# EAGLE design Gen7_ICSP (EAGLE 5.10)
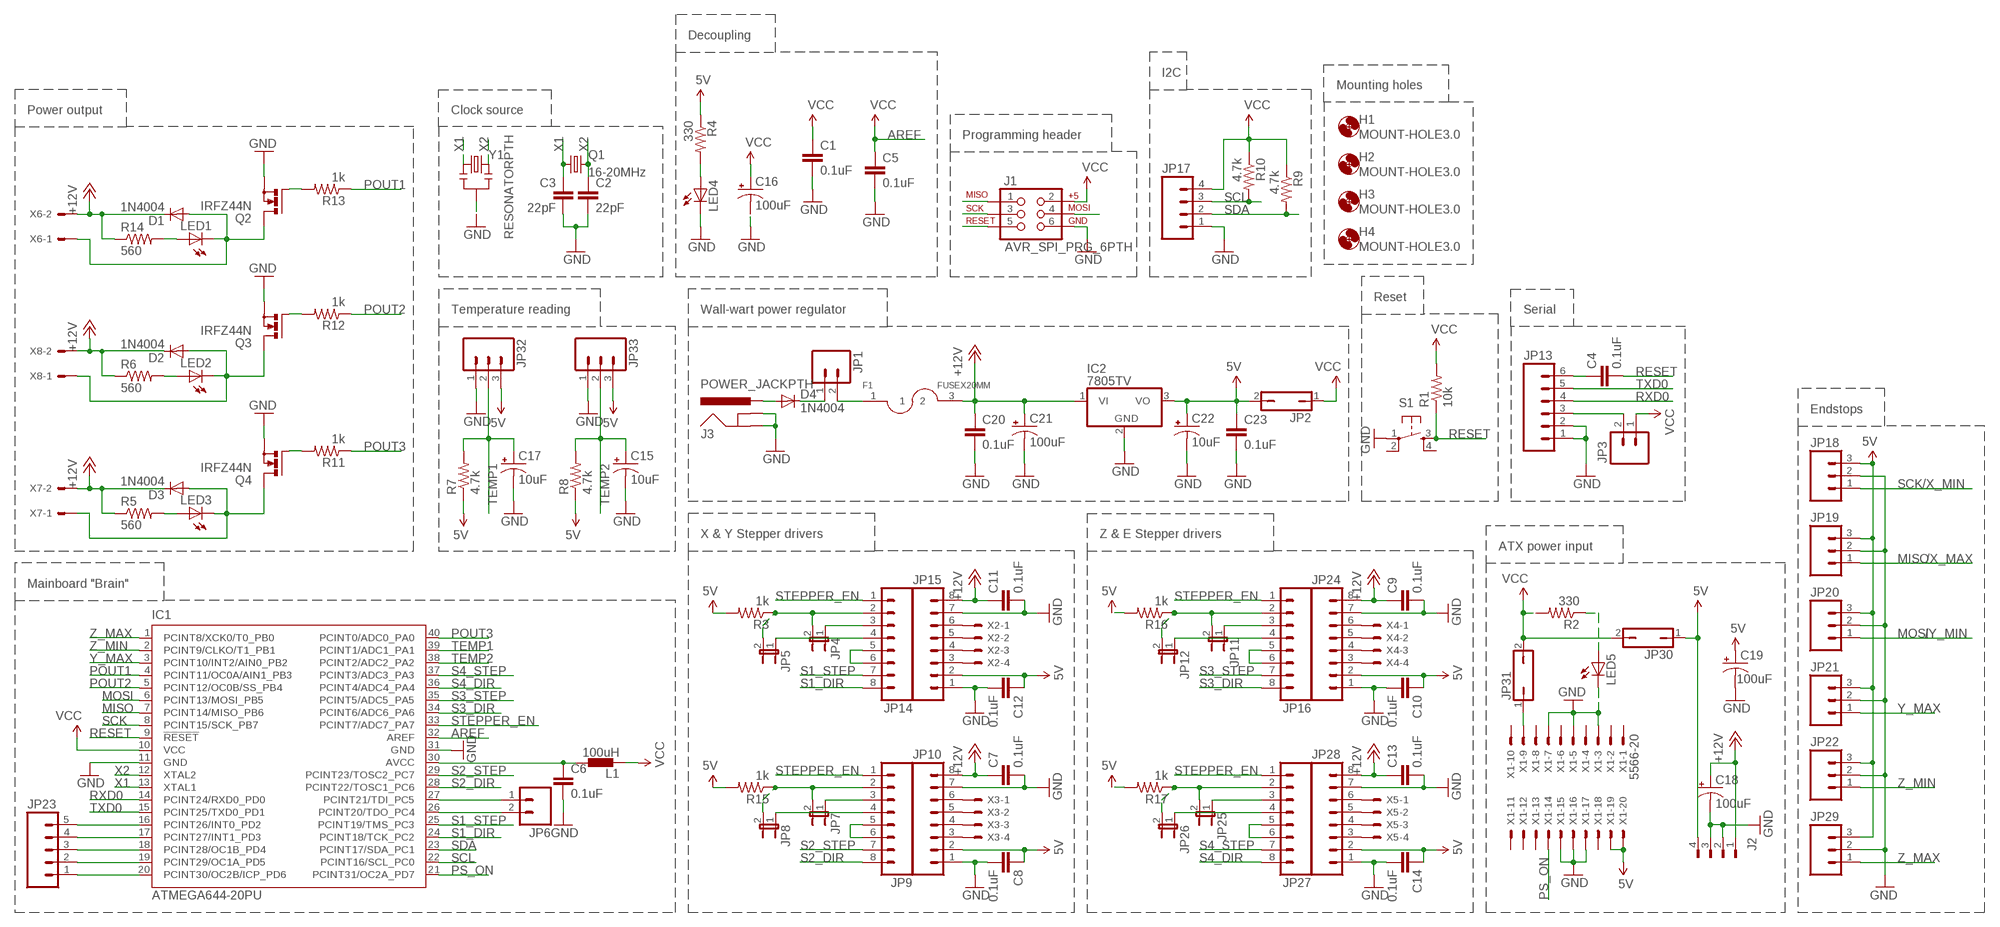
[diagram p0: schematic, sheet 1]

## Parts
C1  0.1uF  CAPPTH  [CAP-PTH-SMALL]
C2  22pF  CAPPTH  [CAP-PTH-SMALL]
C3  22pF  CAPPTH  [CAP-PTH-SMALL]
C4  0.1uF  CAP_  [AXIAL-5MM]
C5  0.1uF  CAPPTH  [CAP-PTH-SMALL]
C6  0.1uF  CAPPTH  [CAP-PTH-SMALL]
C7  0.1uF  CAPPTH  [CAP-PTH-SMALL]
C8  0.1uF  CAPPTH  [CAP-PTH-SMALL]
C9  0.1uF  CAPPTH  [CAP-PTH-SMALL]
C10  0.1uF  CAPPTH  [CAP-PTH-SMALL]
C11  0.1uF  CAPPTH  [CAP-PTH-SMALL]
C12  0.1uF  CAPPTH  [CAP-PTH-SMALL]
C13  0.1uF  CAPPTH  [CAP-PTH-SMALL]
C14  0.1uF  CAPPTH  [CAP-PTH-SMALL]
C15  10uF  CAP_POLPTH2  [CPOL-RADIAL-10UF-25V]
C16  100uF  CAP_POLPTH1  [CPOL-RADIAL-100UF-25V]
C17  10uF  CAP_POLPTH2  [CPOL-RADIAL-10UF-25V]
C18  100uF  CAP_POLPTH1  [CPOL-RADIAL-100UF-25V]
C19  100uF  CAP_POLPTH1  [CPOL-RADIAL-100UF-25V]
C20  0.1uF  CAPPTH  [CAP-PTH-SMALL]
C21  100uF  CAP_POLPTH1  [CPOL-RADIAL-100UF-25V]
C22  10uF  CAP_POLPTH2  [CPOL-RADIAL-10UF-25V]
C23  0.1uF  CAPPTH  [CAP-PTH-SMALL]
D1  1N4004  [DO41-10]
D2  1N4004  [DO41-10]
D3  1N4004  [DO41-10]
D4  1N4004  DIODE-C1702-05  [C1702-05]
F1  FUSEX20MM  [FUSE_5MM]
H1  MOUNT-HOLE3.0  [3,0]
H2  MOUNT-HOLE3.0  [3,0]
H3  MOUNT-HOLE3.0  [3,0]
H4  MOUNT-HOLE3.0  [3,0]
IC1  ATMEGA644-20PU  [DIL40]
IC2  7805TV  [TO220V]
J1  AVR_SPI_PRG_6PTH  [2X3]
J2  FLOPPY-4350211  [350211]
J3  POWER_JACKPTH  [POWER_JACK_PTH]
JP1  M02PTH  [1X02]
JP2  JP1Q  [JP1]
JP3  M02PTH  [1X02]
JP4  JUMPER-2PTH  [1X02]
JP5  JUMPER-2PTH  [1X02]
JP6  M02PTH  [1X02]
JP7  JUMPER-2PTH  [1X02]
JP8  JUMPER-2PTH  [1X02]
JP9  M08LONGPADS  [1X08_LONGPADS]
JP10  M08LONGPADS  [1X08_LONGPADS]
JP11  JUMPER-2PTH  [1X02]
JP12  JUMPER-2PTH  [1X02]
JP13  M06SIP  [1X06]
JP14  M08LONGPADS  [1X08_LONGPADS]
JP15  M08LONGPADS  [1X08_LONGPADS]
JP16  M08LONGPADS  [1X08_LONGPADS]
JP17  M04PTH  [1X04]
JP18  M03POLAR  [MOLEX-1X3]
JP19  M03POLAR  [MOLEX-1X3]
JP20  M03POLAR  [MOLEX-1X3]
JP21  M03POLAR  [MOLEX-1X3]
JP22  M03POLAR  [MOLEX-1X3]
JP23  M05PTH  [1X05]
JP24  M08LONGPADS  [1X08_LONGPADS]
JP25  JUMPER-2PTH  [1X02]
JP26  JUMPER-2PTH  [1X02]
JP27  M08LONGPADS  [1X08_LONGPADS]
JP28  M08LONGPADS  [1X08_LONGPADS]
JP29  M03POLAR  [MOLEX-1X3]
JP30  JP1Q  [JP1]
JP31  JP1Q  [JP1]
JP32  M03POLAR  [MOLEX-1X3]
JP33  M03POLAR  [MOLEX-1X3]
L1  100uH  BL01RN1A  [BL01RN1A]
LED1  LED3MM  [LED3MM]
LED2  LED3MM  [LED3MM]
LED3  LED3MM  [LED3MM]
LED4  LED3MM  [LED3MM]
LED5  LED3MM  [LED3MM]
Q1  16-20MHz  CRYSTALHC49US  [HC49US]
Q2  IRFZ44N  IRF512  [TO220BV]
Q3  IRFZ44N  IRF512  [TO220BV]
Q4  IRFZ44N  IRF512  [TO220BV]
R1  10k  R-US_0207/7  [0207/7]
R2  330  R-US_0207/2V  [0207/2V]
R3  1k  R-US_0207/7  [0207/7]
R4  330  R-US_0207/5V  [0207/5V]
R5  560  R-US_0207/7  [0207/7]
R6  560  R-US_0207/7  [0207/7]
R7  4.7k  R-US_0207/7  [0207/7]
R8  4.7k  R-US_0207/5V  [0207/5V]
R9  4.7k  R-US_0207/2V  [0207/2V]
R10  4.7k  R-US_0207/2V  [0207/2V]
R11  1k  R-US_0207/7  [0207/7]
R12  1k  R-US_0207/7  [0207/7]
R13  1k  R-US_0207/7  [0207/7]
R14  560  R-US_0207/7  [0207/7]
R15  1k  R-US_0207/7  [0207/7]
R16  1k  R-US_0207/7  [0207/7]
R17  1k  R-US_0207/7  [0207/7]
S1  TAC_SWITCHPTH  [TACTILE-PTH]
X1  5566-20  [5566-20]
X2  KK-156-4  [KK-156-4]
X3  KK-156-4  [KK-156-4]
X4  KK-156-4  [KK-156-4]
X5  KK-156-4  [KK-156-4]
X6  KK-156-2  [KK-156-2]
X7  KK-156-2  [KK-156-2]
X8  KK-156-2  [KK-156-2]
Y1  RESONATORPTH  [RESONATOR-PTH]

## Nets
5V: C8.1 C10.1 C12.1 C14.1 C19.1(+) C22.1(+) C23.1 IC2.3(VO) J2.4 JP2.2 JP10.2 JP15.2 JP24.2 JP28.2 JP30.1 JP32.3 JP33.3 R3.2 R7.1 R8.1 R15.2 R16.2 R17.2 X1.19 X1.20
+12V: C7.1 C9.1 C11.1 C13.1 C18.1(+) C20.1 C21.1(+) D1.C D2.C D3.C F1.3 IC2.1(VI) J2.1 JP10.8 JP15.8 JP24.8 JP28.8 R5.1 R6.1 R14.1 X6.2 X7.2 X8.2
AREF: C5.1 IC1.32(AREF) ; supply symbol labelled VCC
GND: C1.2 C2.2 C3.2 C5.2 C6.2 C7.2 C8.2 C9.2 C10.2 C11.2 C12.2 C13.2 C14.2 C15.2(-) C16.2(-) C17.2(-) C18.2(-) C19.2(-) C20.2 C21.2(-) C22.2(-) C23.2 IC1.11(GND) IC1.31(GND) IC2.2(GND) J1.6 J2.2 J2.3 J3.GND J3.GNDBREAK JP10.1 JP10.7 JP13.1 JP13.2 JP15.1 JP15.7 JP17.1 JP18.2 JP19.2 JP20.2 JP21.2 JP22.2 JP24.1 JP24.7 JP28.1 JP28.7 JP29.2 JP32.1 JP33.1 LED4.K(C) LED5.K(C) Q2.S Q3.S Q4.S S1.1 X1.3 X1.5 X1.7 X1.15 X1.16 X1.17 Y1.2
MISO: IC1.7(PCINT14/MISO_PB6) J1.1 JP19.1
MOSI: IC1.6(PCINT13/MOSI_PB5) J1.4 JP20.1
N$1: LED1.A R14.2
N$2: Q3.G R12.2
N$3: D1.A LED1.K(C) Q2.D X6.1
N$4: Q4.G R11.2
N$5: Q2.G R13.2
N$6: JP3.2 JP13.3
N$7: D2.A LED2.K(C) Q3.D X8.1
N$8: LED2.A R6.2
N$9: D3.A LED3.K(C) Q4.D X7.1
N$10: LED3.A R5.2
N$11: JP31.1 X1.9
N$12: LED5.A R2.1
N$13: C4.P$1 JP13.6
N$14: LED4.A R4.2
N$16: C6.1 IC1.30(AVCC) L1.2
N$18: JP15.6 X2.1
N$21: IC1.20(PCINT30/OC2B/ICP_PD6) JP23.1
N$22: IC1.19(PCINT29/OC1A_PD5) JP23.2
N$23: IC1.26(PCINT20/TDO_PC4) JP6.2
N$24: JP15.5 X2.2
N$25: JP14.5 JP14.6
N$26: JP5.1 JP14.4
N$27: JP4.1 JP14.3
N$28: JP4.2 JP5.2 JP14.2 R3.1
N$29: JP15.4 X2.3
N$30: JP15.3 X2.4
N$31: JP9.5 JP9.6
N$32: JP8.1 JP9.4
N$33: JP7.1 JP9.3
N$35: JP10.6 X3.1
N$36: JP10.5 X3.2
N$37: JP10.4 X3.3
N$38: JP10.3 X3.4
N$39: JP16.5 JP16.6
N$40: JP12.1 JP16.4
N$41: JP11.1 JP16.3
N$42: JP11.2 JP12.2 JP16.2 R16.1
N$43: JP24.6 X4.1
N$44: JP24.5 X4.2
N$45: JP24.4 X4.3
N$46: JP24.3 X4.4
N$47: JP27.5 JP27.6
N$48: JP26.1 JP27.4
N$49: JP25.1 JP27.3
N$50: JP25.2 JP26.2 JP27.2 R17.1
N$51: JP28.6 X5.1
N$52: JP28.5 X5.2
N$53: JP28.4 X5.3
N$54: JP28.3 X5.4
N$55: IC1.18(PCINT28/OC1B_PD4) JP23.3
N$56: IC1.17(PCINT27/INT1_PD3) JP23.4
N$57: IC1.16(PCINT26/INT0_PD2) JP23.5
N$58: IC1.27(PCINT21/TDI_PC5) JP6.1
N$68: D4.A J3.PWR
N$70: F1.1 JP1.2
N$72: D4.C JP1.1
N$90: JP7.2 JP8.2 JP9.2 R15.1
POUT1: IC1.4(PCINT11/OC0A/AIN1_PB3) R13.1
POUT2: IC1.5(PCINT12/OC0B/SS_PB4) R12.1
POUT3: IC1.40(PCINT0/ADC0_PA0) R11.1
PS_ON: IC1.21(PCINT31/OC2A_PD7) X1.14
RESET: C4.P$2 IC1.9(!RESET) J1.5 R1.1 S1.3
RXD0: IC1.14(PCINT24/RXD0_PD0) JP13.4
S1_DIR: IC1.24(PCINT18/TCK_PC2) JP14.8
S1_STEP: IC1.25(PCINT19/TMS_PC3) JP14.7
S2_DIR: IC1.28(PCINT22/TOSC1_PC6) JP9.8
S2_STEP: IC1.29(PCINT23/TOSC2_PC7) JP9.7
S3_DIR: IC1.34(PCINT6/ADC6_PA6) JP16.8
S3_STEP: IC1.35(PCINT5/ADC5_PA5) JP16.7
S4_DIR: IC1.36(PCINT4/ADC4_PA4) JP27.8
S4_STEP: IC1.37(PCINT3/ADC3_PA3) JP27.7
SCK: IC1.8(PCINT15/SCK_PB7) J1.3 JP18.1
SCL: IC1.22(PCINT16/SCL_PC0) JP17.3 R10.2
SDA: IC1.23(PCINT17/SDA_PC1) JP17.2 R9.2
STEPPER_EN: IC1.33(PCINT7/ADC7_PA7) JP9.1 JP14.1 JP16.1 JP27.1
TEMP1: C17.1(+) IC1.39(PCINT1/ADC1_PA1) JP32.2 R7.2
TEMP2: C15.1(+) IC1.38(PCINT2/ADC2_PA2) JP33.2 R8.2
TXD0: IC1.15(PCINT25/TXD0_PD1) JP13.5
VCC: C1.1 C16.1(+) IC1.10(VCC) J1.2 JP2.1 JP3.1 JP17.4 JP18.3 JP19.3 JP20.3 JP21.3 JP22.3 JP29.3 JP30.2 JP31.2 L1.1 R1.2 R2.2 R4.1 R9.1 R10.1 ; supply symbol labelled 5V
X1: C3.1 IC1.13(XTAL1) Q1.1 Y1.1
X2: C2.1 IC1.12(XTAL2) Q1.2 Y1.3
Y_MAX: IC1.3(PCINT10/INT2/AIN0_PB2) JP21.1
Z_MAX: IC1.1(PCINT8/XCK0/T0_PB0) JP29.1
Z_MIN: IC1.2(PCINT9/CLKO/T1_PB1) JP22.1
Unconnected: S1.2 S1.4 X1.1 X1.2 X1.4 X1.6 X1.8 X1.10 X1.11 X1.12 X1.13 X1.18

## Notes on the sheet
- Decoupling
- I2C
- Mounting holes
- Power output | Clock source
- Programming header
- Reset
- Temperature reading | Wall-wart power regulator | Serial
- Endstops
- /X_MIN
- X & Y Stepper drivers | Z & E Stepper drivers
- ATX power input
- /X_MAX
- Mainboard "Brain"
- /Y_MIN

## Library data of the parts
C1-C14 C20 C23 = SparkFun:CAP: Capacitor Standard 0603 ceramic capacitor, and 0.1" leaded capacitor.
C15-C19 C21 C22 = SparkFun:CAP_POL: Capacitor Polarized These are standard SMD and PTH capacitors. Normally 10uF, 47uF, and 100uF in electrolytic and tantalum varieties. Always verify the external diameter of the through hole cap, it varies with capacity, voltage, and manufacturer. The EIA devices should be standard.
D1-D3 = diode:1N4004: DIODE general purpose rectifier, 1 A
D4 = diode:DIODE-: DIODE
F1 = SparkFun:FUSE
H1-H4 = holes:MOUNT-HOLE: MOUNTING HOLE with drill center marker
IC1 = atmel:ATMEGA644-*PU: 8-bit Microcontroller with 64K Bytes In-System Programmable Flash Auto generated by make-symbol-device-package-bsdl.ulp Rev. 34 Source: http://www.atmel.com/dyn/resources/prod_documents/doc2593.pdf
IC2 = linear:78*: Positive VOLTAGE REGULATOR Source: http://cache.national.com/ds/LM/LM78L05.pdf http://www.fairchildsemi.com/ds/LM/LM7805.pdf
J1 = SparkFun:AVR_SPI_PRG_6: AVR ISP 6 Pin This is the reduced ISP connector for AVR programming. Common on Arduino. This footprint will take up less PCB space and can be used with a 10-pin to 6-pin adapter such as SKU: BOB-08508
J2 = con-amp:FLOPPY-4: MATE N-LOCK Floppy / HDD conector Distributor: Bürklin 71F970
J3 = SparkFun:POWER_JACK: Power Jack This is the standard 5.5mm barrel jack for power. The PTH is the most common, proven, reliable, footprint. All others are experimental. The Slot footprint only works if the mill layer is transmitted to the PCB fab house so be warned. Spark Fun Electronics SKU : PRT-00119. Mating wall wart : TOL-00298 (and others)
JP1 JP3 JP6 = SparkFun:M02: Header 2 Standard 2-pin 0.1" header. Use with straight break away headers (SKU : PRT-00116), right angle break away headers (PRT-00553), swiss pins (PRT-00743), machine pins (PRT-00117), and female headers (PRT-00115). Molex polarized connector foot print use with SKU : PRT-08233 with associated crimp pins and housings.
JP2 JP30 JP31 = jumper:JP1Q: JUMPER
JP4 JP5 JP7 JP8 JP11 JP12 JP25 JP26 = SparkFun:JUMPER-2: Jumper Basic 0.1" spaced jumper. Use with breakaway headers.
JP9 JP10 JP14-JP16 JP24 JP27 JP28 = SparkFun:M08: Header 8 Standard 8-pin 0.1" header. Use with straight break away headers (SKU : PRT-00116), right angle break away headers (PRT-00553), swiss pins (PRT-00743), machine pins (PRT-00117), and female headers (PRT-00115).
JP13 = SparkFun:M06: Header 6 Standard 6-pin 0.1" header. Use with straight break away headers (SKU : PRT-00116), right angle break away headers (PRT-00553), swiss pins (PRT-00743), machine pins (PRT-00117), and female headers (PRT-00115). Molex polarized connector foot print use with SKU : PRT-08094 with associated crimp pins and housings. NOTES ON THE VARIANTS LOCK and LOCK_LONGPADS... This footprint was designed to help hold the alignment of a through-hole component (i.e. 6-pin header) while soldering it into place. You may notice that each hole has been shifted either up or down by 0.005 of an inch from it's more standard position (which is a perfectly straight line). This slight alteration caused the pins (the squares in the middle) to touch the edges of the holes. Because they are alternating, it causes a "brace" to hold the component in place. 0.005 has proven to be the perfect amount of "off-center" position when using our standard breakaway headers. Although looks a little odd when you look at the bare footprint, once you have a header in there, the alteration is very hard to notice. Also, if you push a header all the way into place, it is covered up entirely on the bottom side. This idea of altering the position of holes to aid alignment will be further integrated into the Sparkfun Library for other footprints. It can help hold any component with 3 or more connection pins.
JP17 = SparkFun:M04: Header 4 Standard 4-pin 0.1" header. Use with straight break away headers (SKU : PRT-00116), right angle break away headers (PRT-00553), swiss pins (PRT-00743), machine pins (PRT-00117), and female headers (PRT-00115). Molex polarized connector foot print use with SKU : PRT-08231 with associated crimp pins and housings.
JP18-JP22 JP29 JP32 JP33 = SparkFun:M03: Header 3 Standard 3-pin 0.1" header. Use with straight break away headers (SKU : PRT-00116), right angle break away headers (PRT-00553), swiss pins (PRT-00743), machine pins (PRT-00117), and female headers (PRT-00115). Molex polarized connector foot print use with SKU : PRT-08232 with associated crimp pins and housings.
JP23 = SparkFun:M05: Header 5 Standard 5-pin 0.1" header. Use with straight break away headers (SKU : PRT-00116), right angle break away headers (PRT-00553), swiss pins (PRT-00743), machine pins (PRT-00117), and female headers (PRT-00115). Molex polarized connector foot print use with SKU : PRT-08230 with associated crimp pins and housings.
L1 = inductors:BL0: Noise Suppression Products/EMI Suppression Filters, Lead EMIFIL(R) Inductor Type Source: http://www.murata.com .. BL01RN1_DS.pdf
LED1-LED5 = SparkFun:LED: LEDs Standard schematic elements and footprints for 5mm, 3mm, 1206, and 0603 sized LEDs. 5mm - Spark Fun Electronics SKU : COM-00529 (and others)
Q1 = SparkFun:CRYSTAL: Crystals Various standard crystals. Proven footprints. Spark Fun Electronics SKU : COM-00534
Q2-Q4 = transistor-power:IRF512: N-CHANNEL MOS FET
R1-R17 = rcl:R-US_: RESISTOR, American symbol
S1 = SparkFun:TAC_SWITCH: Momentary Switch Button commonly used for reset or general input. Spark Fun Electronics SKU : COM-00097
X1 = con-molex:5566-20: Mini FIT connector 20 pol ATX PC-Motherboard Power connector Source: http://www.molex.com
X2-X5 = con-molex:KK-156-4: KK 156 HEADER Source: http://www.molex.com/pdm_docs/sd/026604100_sd.pdf
X6-X8 = con-molex:KK-156-2: KK 156 HEADER Source: http://www.molex.com/pdm_docs/sd/026604100_sd.pdf
Y1 = SparkFun:RESONATOR: Resonator Small SMD resonator. This is the itty bitty 10/20MHz resonators with built in caps. CSTCE10M0G55 and CSTCE20M0V53. Footprint has been reviewed closely but hasn't been tested yet.

## Board
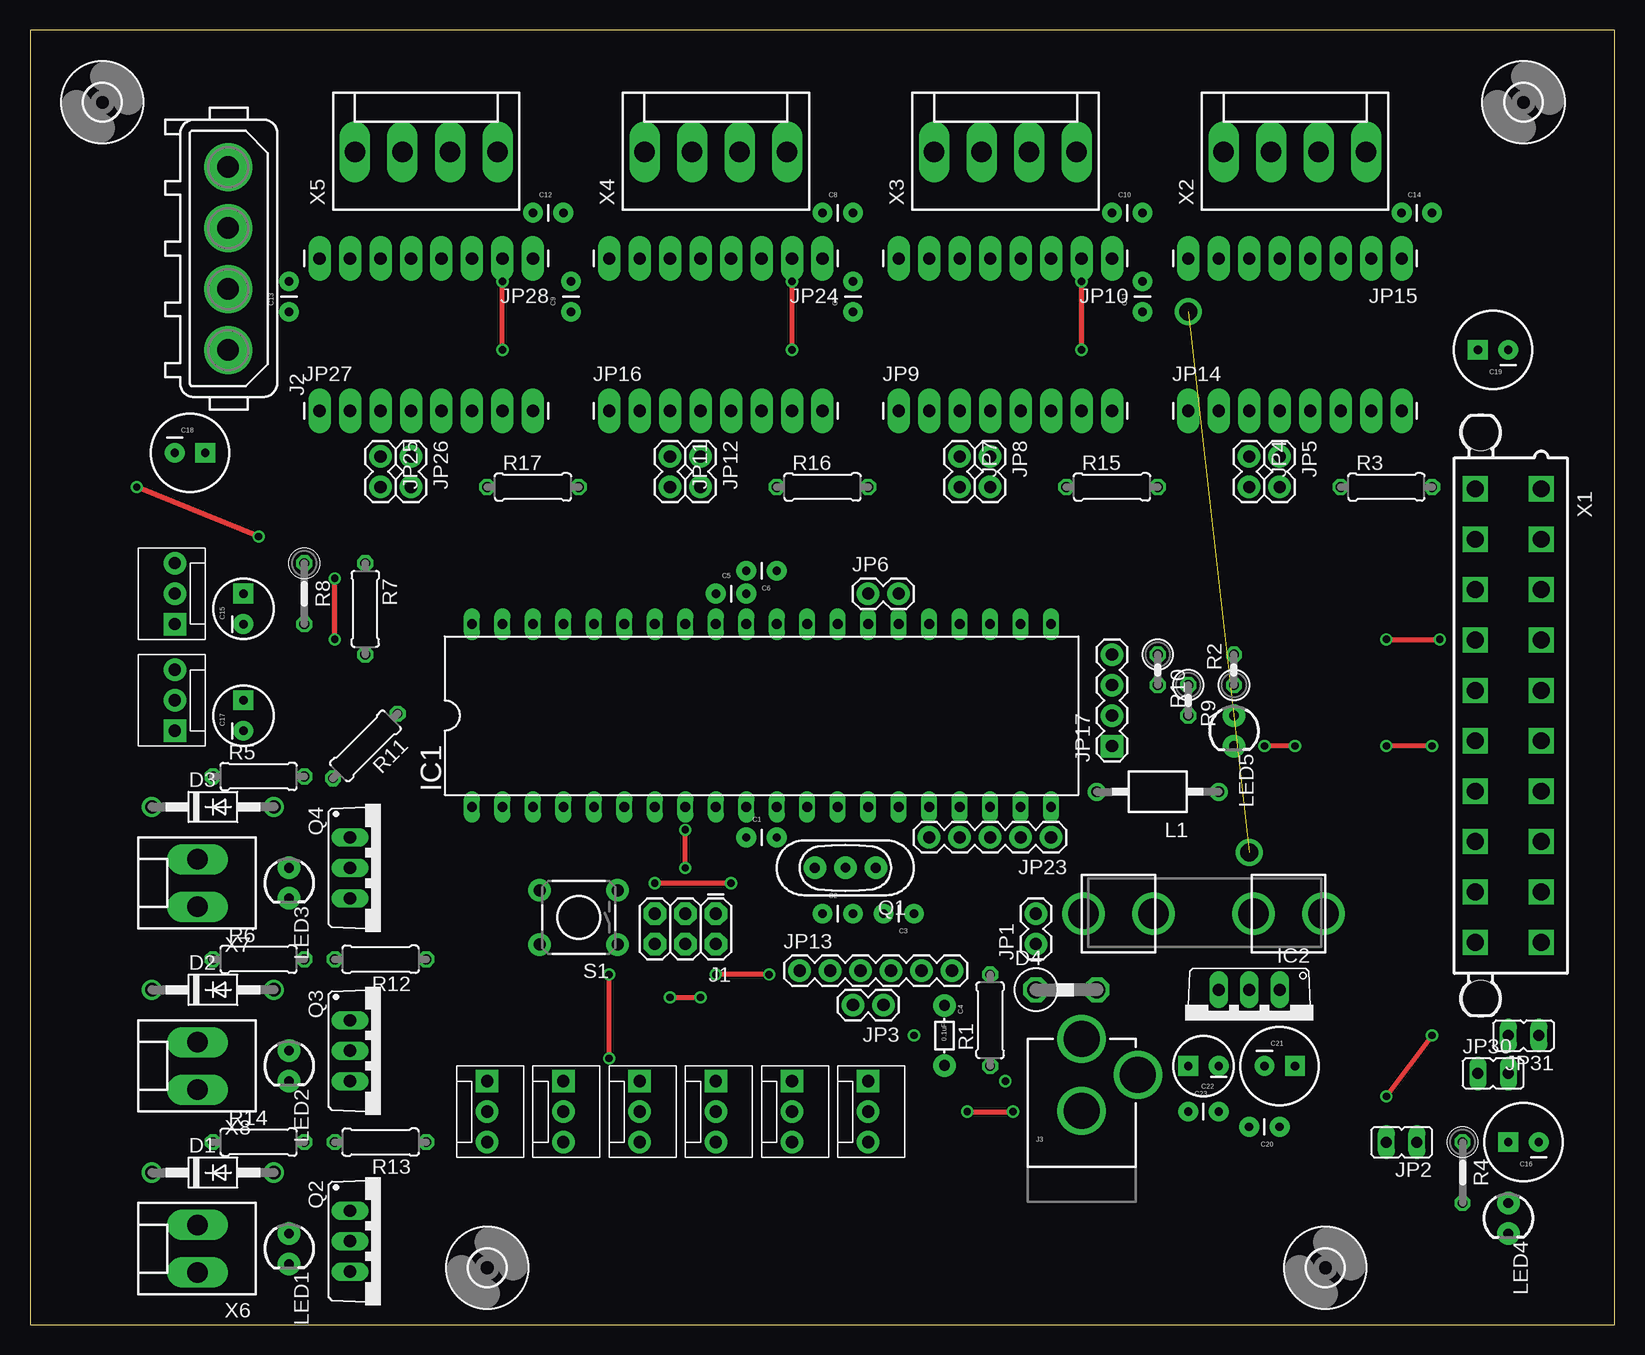
[diagram p1: board, top side]
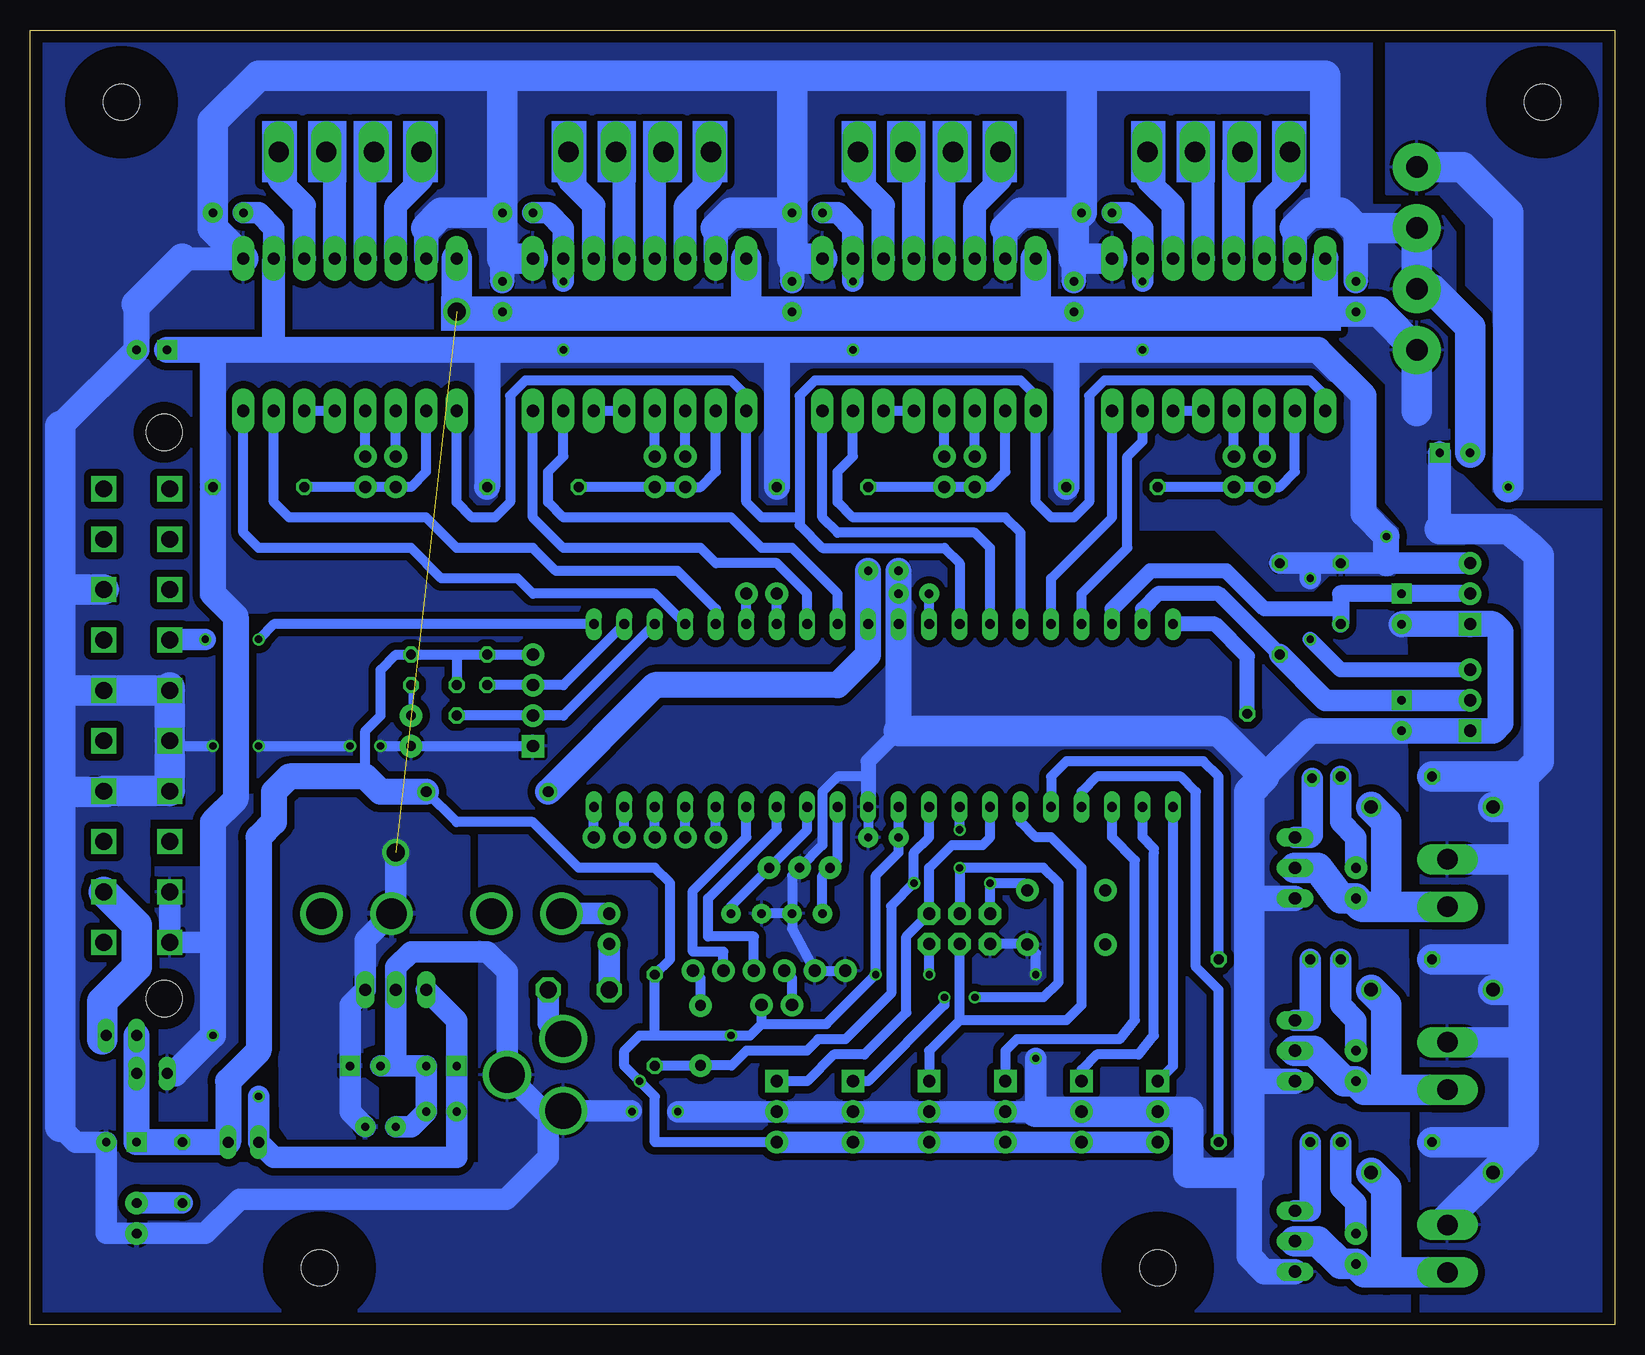
[diagram p2: board, bottom side, seen from below]

Size 132.08 x 107.95 mm. Coordinates in mm from the lower left corner, seen from the top.
Outline: 0,0 132.08,0 132.08,107.95 0,107.95 0,0
Copper layers (1*16): Top 0.035mm / dielectric 1.5mm / Bottom 0.035mm
Design rules "new": minimum track width 16mil, minimum drill 24mil, track to track 8mil, track to pad 8mil, pad to pad 8mil, via to via 8mil, smd to smd 8mil, copper to edge 40mil, drill to drill 8mil, minimum pad ring 10mil, minimum via ring 8mil, stop-mask expansion 4mil, vias tented up to drill 0mil, thermal gap 10mil

### Footprints (pad centres in the part's own frame; a part is rotated, then mirrored left to right if it is on the bottom)
CAP-PTH-SMALL = drill 0.7 pad 1.651 round: 1 0,0; 2 2.54,0
AXIAL-5MM = drill 0.9 pad 1.88 round: P$1 -2.5,0; P$2 2.5,0
CPOL-RADIAL-10UF-25V = drill 0.7 pad 1.651 square: 1 1.27,0 | drill 0.7 pad 1.651 round: 2 -1.27,0
CPOL-RADIAL-100UF-25V = drill 0.7 pad 1.651 square: 1 1.27,0 | drill 0.7 pad 1.651 round: 2 -1.27,0
DO41-10 = drill 1.118 round: A 5.08,0; C -5.08,0
C1702-05 = drill 1.397 octagon: A 2.54,0; C -2.54,0
FUSE_5MM = drill 2.54 pad 3.556 round: 1 0,-10; 2 0,-4.158; 3 0,4.158; 4 0,10
3,0 = hole 3: 0,0
DIL40 = drill 0.813 long: 1 -24.13,-7.62; 2 -21.59,-7.62; 3 -19.05,-7.62; 4 -16.51,-7.62; 5 -13.97,-7.62; 6 -11.43,-7.62; 7 -8.89,-7.62; 8 -6.35,-7.62; 9 -3.81,-7.62; 10 -1.27,-7.62; 11 1.27,-7.62; 12 3.81,-7.62; 13 6.35,-7.62; 14 8.89,-7.62; 15 11.43,-7.62; 16 13.97,-7.62; 17 16.51,-7.62; 18 19.05,-7.62; 19 21.59,-7.62; 20 24.13,-7.62; 21 24.13,7.62; 22 21.59,7.62; 23 19.05,7.62; 24 16.51,7.62; 25 13.97,7.62; 26 11.43,7.62; 27 8.89,7.62; 28 6.35,7.62; 29 3.81,7.62; 30 1.27,7.62; 31 -1.27,7.62; 32 -3.81,7.62; 33 -6.35,7.62; 34 -8.89,7.62; 35 -11.43,7.62; 36 -13.97,7.62; 37 -16.51,7.62; 38 -19.05,7.62; 39 -21.59,7.62; 40 -24.13,7.62
TO220V = drill 1.016 long: 1 -2.54,-2.54; 2 0,-2.54; 3 2.54,-2.54
2X3 = drill 1.016 pad 1.88 octagon: 1 0,0; 2 0,2.54; 3 2.54,0; 4 2.54,2.54; 5 5.08,0; 6 5.08,2.54
350211 = drill 1.8 pad 4 round: 1 -7.62,0; 2 -2.54,0; 3 2.54,0; 4 7.62,0
POWER_JACK_PTH = drill 2.997 round: GND 0,7.7; GNDBREAK 4.7,10.7; PWR 0,13.7
1X02 = drill 1.016 pad 1.88 round: 1 0,0; 2 2.54,0
JP1 = drill 0.914 long: 1 0,-1.27; 2 0,1.27
1X08_LONGPADS = drill 1.016 pad 1.88 long: 1 0,0; 2 2.54,0; 3 5.08,0; 4 7.62,0; 5 10.16,0; 6 12.7,0; 7 15.24,0; 8 17.78,0
1X06 = drill 1.016 pad 1.88 round: 1 0,0; 2 2.54,0; 3 5.08,0; 4 7.62,0; 5 10.16,0; 6 12.7,0
1X04 = drill 1.016 pad 1.88 square: 1 0,0 | drill 1.016 pad 1.88 round: 2 2.54,0; 3 5.08,0; 4 7.62,0
MOLEX-1X3 = drill 1.016 pad 1.88 square: 1 0,0 | drill 1.016 pad 1.88 round: 2 2.54,0; 3 5.08,0
1X05 = drill 1.016 pad 1.88 round: 1 0,0; 2 2.54,0; 3 5.08,0; 4 7.62,0; 5 10.16,0
BL01RN1A = drill 0.9 pad 1.5 round: 1 -5.08,0; 2 5.08,0
LED3MM = drill 0.813 pad 1.88 round: A -1.27,0; K 1.27,0
HC49US = drill 0.813 round: 1 -2.54,0; 2 2.54,0
TO220BV = drill 1.016 long: D 0,-2.54; G -2.54,-2.54; S 2.54,-2.54
0207/7 = drill 0.813 octagon: 1 -3.81,0; 2 3.81,0
0207/2V = drill 0.813 octagon: 1 -1.27,0; 2 1.27,0
0207/5V = drill 0.813 octagon: 1 -2.54,0; 2 2.54,0
TACTILE-PTH = drill 1.016 pad 1.88 round: 1 -3.251,2.261; 2 3.251,2.261; 3 -3.251,-2.261; 4 3.251,-2.261
5566-20 = drill 1.4 square: 1 18.9,-2.75; 2 14.7,-2.75; 3 10.5,-2.75; 4 6.3,-2.75; 5 2.1,-2.75; 6 -2.1,-2.75; 7 -6.3,-2.75; 8 -10.5,-2.75; 9 -14.7,-2.75; 10 -18.9,-2.75; 11 18.9,2.75; 12 14.7,2.75; 13 10.5,2.75; 14 6.3,2.75; 15 2.1,2.75; 16 -2.1,2.75; 17 -6.3,2.75; 18 -10.5,2.75; 19 -14.7,2.75; 20 -18.9,2.75 | hole 3: 23.6,2.29; -23.6,2.29
KK-156-4 = drill 1.7 pad 2.184 long: 1 -5.94,0; 2 -1.98,0; 3 1.98,0; 4 5.94,0
KK-156-2 = drill 1.7 pad 2.184 long: 1 -1.98,0; 2 1.98,0
RESONATOR-PTH = drill 0.8 pad 1.88 round: 1 -2.54,0; 2 0,0; 3 2.54,0

### Placement (x,y rotation side)
C1  59.69,40.64 0 top
C2  66.04,34.29 0 top
C3  73.66,34.29 180 top
C4  76.2,24.13 270 top
C5  57.15,60.96 0 top
C6  62.23,62.87 180 top
C7  68.58,84.45 90 top
C8  66.04,92.71 0 top
C9  45.09,84.45 90 top
C10  90.17,92.71 0 top
C11  92.71,84.45 90 top
C12  41.91,92.71 0 top
C13  21.59,84.45 90 top
C14  114.3,92.71 0 top
C15  17.78,59.69 90 top
C16  124.46,15.24 180 top
C17  17.78,50.8 90 top
C18  13.34,72.71 0 top
C19  121.92,81.28 180 top
C20  104.14,16.51 180 top
C21  104.14,21.59 0 top
C22  97.79,21.59 180 top
C23  96.52,17.78 0 top
D1  15.24,12.7 0 top
D2  15.24,27.94 0 top
D3  15.24,43.18 0 top
D4  86.36,27.94 0 top
F1  97.79,34.29 270 top
H1  124.46,101.92 0 top
H2  107.95,4.76 0 top
H3  6.03,101.92 0 top
H4  38.1,4.76 0 top
IC1  60.96,50.8 0 top
IC2  101.6,25.4 180 top
J1  57.15,34.29 180 top
J2  16.51,88.9 90 top
J3  87.63,10.16 0 top
JP1  83.82,31.75 90 top
JP2  114.3,15.24 90 top
JP3  71.12,26.67 180 top
JP4  101.6,72.39 270 top
JP5  104.14,72.39 270 top
JP6  69.85,60.96 0 top
JP7  77.47,72.39 270 top
JP8  80.01,72.39 270 top
JP9  72.39,76.2 0 top
JP10  90.17,88.9 180 top
JP11  53.34,72.39 270 top
JP12  55.88,72.39 270 top
JP13  64.14,29.53 0 top
JP14  96.52,76.2 0 top
JP15  114.3,88.9 180 top
JP16  48.26,76.2 0 top
JP17  90.17,48.26 90 top
JP18  63.5,20.32 270 top
JP19  69.85,20.32 270 top
JP20  57.15,20.32 270 top
JP21  50.8,20.32 270 top
JP22  44.45,20.32 270 top
JP23  85.09,40.64 180 top
JP24  66.04,88.9 180 top
JP25  29.21,72.39 270 top
JP26  31.75,72.39 270 top
JP27  24.13,76.2 0 top
JP28  41.91,88.9 180 top
JP29  38.1,20.32 270 top
JP30  121.92,20.95 270 top
JP31  124.46,24.13 90 top
JP32  12.06,49.53 90 top
JP33  12.06,58.42 90 top
L1  93.98,44.45 180 top
LED1  21.59,6.35 270 top
LED2  21.59,21.59 270 top
LED3  21.59,36.83 270 top
LED4  123.19,8.89 270 top
LED5  100.33,49.53 270 top
Q1  67.94,38.1 180 top
Q2  29.21,6.99 270 top
Q3  29.21,22.86 270 top
Q4  29.21,38.1 270 top
R1  80.01,25.4 90 top
R2  100.33,54.61 90 top
R3  113.03,69.85 0 top
R4  119.38,12.7 270 top
R5  19.05,45.72 0 top
R6  19.05,30.48 0 top
R7  27.94,59.69 270 top
R8  22.86,60.96 270 top
R9  96.52,52.07 270 top
R10  93.98,54.61 270 top
R11  27.94,48.26 225 top
R12  29.21,30.48 180 top
R13  29.21,15.24 180 top
R14  19.05,15.24 0 top
R15  90.17,69.85 0 top
R16  66.04,69.85 0 top
R17  41.91,69.85 0 top
S1  45.72,33.97 180 top
X1  123.19,50.8 90 top
X2  105.41,97.79 0 top
X3  81.28,97.79 0 top
X4  57.15,97.79 0 top
X5  33.02,97.79 0 top
X6  13.97,6.35 90 top
X7  13.97,36.83 90 top
X8  13.97,21.59 90 top
Y1  67.94,38.1 180 top

### Tracks (layer width: path | path; a pad name or v marks a point on that pad's centre or on a via)
5V  (via drill 0.61)
  Top 0.406: v39.37,81.28 v39.37,87 | v63.5,81.28 v63.5,87 | v87.63,81.28 v87.63,87 | v19.05,65.72 v8.89,69.85 | v25.4,57.15 v25.4,62.23 | v116.84,24.13 v113.03,19.05
  Bottom 0.406: 116.84,31.75 116.99,31.9 | 120.02,20.95 JP30.1
  Bottom 1.27: JP32.3 22.86,54.61 v25.4,57.15
  Bottom 1.778: C12.1 40.64,92.71 39.37,91.44 JP28.2 v39.37,87 | v63.5,87 JP24.2 63.5,91.44 64.77,92.71 C8.1 | v87.63,87 JP10.2 87.63,91.44 88.9,92.71 C10.1 | JP15.2 111.76,91.44 113.03,92.71 C14.1 | X1.19 X1.20 116.99,31.9 | 25.4,63.5 R8.1 19.05,63.5 JP33.3 | 25.4,63.5 R7.1 | v25.4,62.23 25.4,63.5 | IC2.3 96.52,25.4 C22.1 C23.1 96.52,13.97 111.76,13.97 JP2.2 v113.03,19.05
  Bottom 1.93: 111.76,81.28 JP15.2
  Bottom 2.184: 45.72,81.28 v39.37,81.28 24.77,81.28 20.95,77.47 20.95,67.63 v19.05,65.72 19.05,63.5 | 45.72,81.28 R17.2 | 69.85,81.28 v63.5,81.28 45.72,81.28 | 69.85,81.28 R16.2 | 69.85,81.28 v87.63,81.28 93.98,81.28 | 93.98,81.28 R15.2 | 116.84,81.28 R3.2 116.84,60.96 114.94,59.05 114.94,43.81 116.84,41.91 116.84,31.75 v116.84,24.13 120.02,20.95 | 93.98,81.28 111.76,81.28 116.84,81.28 | 116.84,81.28 C19.1
  Bottom 2.54: J2.4 12.7,96.52 8.89,92.71 v8.89,69.85
  pour Bottom (isolate 0.61): 0,68.9 0,107.95 19.05,107.95 19.05,94.3 14.61,94.3 12.38,91.76 12.38,86.68 10.16,84.45 10.16,69.53 8.57,68.9
  pour Bottom (isolate 0.61): 121.28,24.77 121.28,16.83 117.16,16.83 117.16,20.95 114.62,23.5 114.62,41.27 113.35,42.55 113.35,44.13 115.89,44.13 117.79,42.23 117.79,38.1 121.6,38.1 121.6,24.77
  pour Bottom (isolate 0.61): 69.22,82.23 68.9,82.23 68.9,59.37 116.52,59.37 117.79,60.64 117.79,82.23
  pour Bottom (isolate 0.61): 24.77,82.23 69.53,82.23 69.53,66.36 33.34,66.36 28.26,61.28 25.08,61.28 23.81,62.55 18.41,62.55 18.1,62.87 18.1,66.36 20,68.26 20,77.47
+12V  (via drill 1.5)  (1 unrouted)
  Bottom 0.406: 7.62,24.13 8.18,23.57 | 7.62,39.37 arc90 8.18,38.81
  Bottom 1.778: 8.26,14.61 8.89,15.24 | C20.1 105.41,17.78 C21.1 105.41,26.67 IC2.1 104.14,32.1 F1.3 101.6,34.64 v101.6,39.37
  Bottom 1.93: 14.61,66.36 C18.1
  Bottom 2.184: 24.13,84.45 JP28.8
  Bottom 2.54: X6.2 13.97,8.89 D1.C 8.26,14.61 7.62,15.24 7.62,24.13 7.62,27.94 | 48.26,84.45 C9.1 24.13,84.45 C13.1 19.68,84.45 J2.1 16.51,76.2 | 48.26,84.45 C7.1 72.39,84.45 | 48.26,84.45 JP24.8 | 72.39,84.45 C11.1 v96.52,84.45 JP15.8 | 72.39,84.45 JP10.8 | 7.62,27.94 7.62,30.48 | 7.62,30.48 7.62,39.37 7.62,43.18 | 14.61,66.36 8.89,66.36 6.99,64.77 6.35,64.14 6.35,46.99 7.62,45.72 | 7.62,43.18 7.62,45.72 | 8.18,23.57 X8.2 | 7.62,27.94 D2.C | 7.62,30.48 R6.1 | 8.18,38.81 X7.2 | 7.62,45.72 R5.1 | 7.62,43.18 D3.C | 8.89,15.24 R14.1
  pour Bottom (isolate 0.61): 0,67.94 9.84,67.94 13.65,71.75 13.65,82.23 15.24,83.82 17.78,83.82 19.37,85.41 25.4,84.45 21.27,80.64 19.05,78.42 19.05,68.58 17.46,66.67 17.46,64.77 16.19,64.77 16.19,0 0,0
  pour Bottom (isolate 0.406): 13.97,74.61 13.65,74.61 13.65,71.75 15.88,71.75 15.88,74.3 13.97,74.3
  pour Bottom (isolate 0.61): 95.57,40.64 96.84,40.64 98.74,42.55 103.5,42.55 104.78,43.81 109.54,43.81 109.86,43.5 109.86,41.27 111.44,39.69 111.12,16.51 110.49,15.56 103.19,15.56 103.19,19.68 104.46,20.64 104.46,23.18 103.5,23.5 103.5,29.84 100.33,32.7 95.57,32.7
AREF
  Bottom 0.813: IC1.32 C5.1
GND  (via drill 0.61)
  Top 0.406: v48.26,22.23 v48.26,29.21 | v116.84,48.26 v113.03,48.26 | v105.41,48.26 v102.87,48.26 | v78.11,17.78 v81.92,17.78
  Bottom 0.406: C12.2 45.09,92.71 | 120.44,48.47 120.65,48.26 | 129.54,60.96 arc90 129.2,61.3 | 120.44,53.13 120.65,53.34 | J3.GND 87.55,17.78 | v81.92,17.78 82,17.86
  Bottom 0.813: IC1.11 C1.2 | JP13.1 JP13.2 68.58,33.02 C2.2 | C2.2 68.58,37.47 Y1.2 66.04,40.01 66.04,44.45 64.77,45.72 62.23,45.72 | C2.2 C3.2 | JP17.1 LED5.K v102.87,48.26 | v113.03,48.26 v105.41,48.26 | 120.65,48.26 v116.84,48.26 | J1.6 49.01,31.75 S1.1 48.26,31 v48.26,29.21
  Bottom 1.27: 59.69,49.53 62.23,46.99 62.23,45.72 IC1.11
  Bottom 1.778: J2.2 15.24,86.36 | X1.15 X1.16 120.44,48.47 | 129.54,16.51 128.27,15.24 C16.2 125.73,7.62 LED4.K 117.47,7.62 114.62,10.48 92.39,10.48 88.9,13.97 88.9,17.86 | v48.26,22.23 48.26,17.78 JP21.2 JP20.2 JP18.2 JP19.2 v78.11,17.78 | 101.6,21.59 IC2.2 101.6,29.84 100.33,31.11 93.98,31.11 92.33,29.46 J3.GNDBREAK 89.33,17.86 88.9,17.86 | 101.6,21.59 C21.2 | 101.6,21.59 C22.2 C23.2 100.33,16.51 C20.2 | 88.9,17.86 J3.GND 82,17.86
  Bottom 1.93: 119.38,88.9 JP15.1
  Bottom 2.032: 99.06,91.44 JP15.7 | 26.67,91.44 JP28.7 | 21.59,91.44 C13.2 | 74.93,91.44 JP10.7 | 50.8,91.44 JP24.7 | 45.09,88.9 C9.2 | 68.58,88.9 C7.2 | 92.71,88.9 C11.2
  Bottom 2.134: Q2.S 29.21,4.45 30.48,5.71 30.48,12.7 | 30.48,35.56 Q4.S | 30.48,20.32 Q3.S | 29.21,45.72 25.4,49.53 C17.2 JP32.1 10.16,49.53
  Bottom 2.184: 129.54,74.93 C19.2 123.19,85.09 | C15.2 JP33.1 10.16,58.42 9.53,57.78 9.53,50.16 10.16,49.53 | C6.2 C5.2 IC1.31 59.69,49.53
  Bottom 2.54: 99.06,91.44 97.79,92.71 C10.2 | 26.67,91.44 25.4,92.71 24.13,92.71 | 92.71,104.14 68.58,104.14 | 92.71,104.14 113.03,104.14 116.84,100.33 C14.2 116.84,91.44 JP15.1 | 68.58,104.14 44.45,104.14 | 44.45,104.14 24.13,104.14 24.13,92.71 | 24.13,92.71 22.86,92.71 21.59,91.44 J2.3 J2.2 | 68.58,104.14 C8.2 | 44.45,104.14 C12.2 49.53,92.71 50.8,91.44 | 92.71,104.14 C10.2 | 74.93,91.44 73.66,92.71 C8.2 | 45.09,92.71 45.09,88.9 JP28.1 | C8.2 68.58,88.9 JP24.1 | C10.2 92.71,88.9 JP10.1 | X1.15 X1.5 129.54,52.9 | X1.7 X1.17 120.44,48.47 | 129.54,44.45 129.54,52.9 | 129.54,44.45 125.73,44.45 | 129.54,74.93 129.54,60.96 129.54,52.9 | 129.2,61.3 X1.3 | 59.69,49.53 33.02,49.53 29.21,45.72 30.48,44.45 30.48,35.56 30.48,20.32 30.48,12.7 35.56,12.7 35.56,17.78 JP29.2 JP22.2 48.26,17.78 | 129.54,16.51 129.54,44.45 | X1.16 120.44,53.13 | 123.19,85.09 119.38,88.9 | C18.2 12.06,83.19 15.24,86.36
  pour Bottom (isolate 0.61): 20.32,107.95 20.32,93.34 15.24,93.34 14.29,92.39 13.34,91.12 13.34,86.04 24.45,86.36 24.45,84.14 20,79.69 20,76.52 17.46,69.85 17.14,0 94.61,0 94.61,42.23 111.12,42.23 132.08,42.23 132.08,107.95
  pour Bottom (isolate 0.61): 93.34,13.34 121.92,13.34 122.24,42.55 132.08,42.86 132.08,0 93.34,0
MISO
  Bottom 0.813: IC1.7 52.07,40.64 52.7,40.01 55.24,40.01 57.15,38.1 J1.1 59.05,32.38 59.05,26.04 62.55,22.54 65.09,22.54 67.31,20.32 JP19.1
MOSI
  Bottom 0.813: JP20.1 57.15,22.86 54.61,25.4 | 54.61,25.4 45.72,25.4 44.45,26.67 44.45,38.1 46.99,40.64 48.26,40.64 49.53,41.91 IC1.6 | 54.61,25.4 J1.4
N$1
  Bottom 1.778: LED1.A 21.59,10.16 22.86,11.43 R14.2
N$2
  Bottom 1.778: R12.2 25.4,25.4 Q3.G
N$3
  Bottom 2.54: X6.1 19.05,4.37 | 19.05,4.37 20.88,4.37 LED1.K 22.86,5.08 24.77,6.99 Q2.D | D1.A 19.05,11.43 19.05,4.37
N$4
  Bottom 0.406: 25.25,40.79 25.4,40.64
  Bottom 1.778: 25.4,40.64 Q4.G | 25.25,40.79 R11.2
N$5
  Bottom 1.778: Q2.G 25.4,9.53 R13.2
N$6
  Bottom 0.813: JP3.2 68.58,28.89 JP13.3
N$7
  Bottom 2.54: X8.1 19.05,19.61 | 19.05,19.61 20.88,19.61 LED2.K 22.54,20.32 25.08,22.86 Q3.D | D2.A 19.05,26.67 19.05,19.61
N$8
  Bottom 1.778: LED2.A 21.59,25.4 22.86,26.67 R6.2
N$9
  Bottom 2.54: D3.A 19.05,41.91 19.05,34.85 | X7.1 19.05,34.85 | 19.05,34.85 20.88,34.85 arc90 LED3.K 22.86,35.56 24.77,38.1 Q4.D
N$10
  Bottom 1.778: LED3.A 21.59,40.64 22.86,41.91 R5.2
N$11
  Bottom 0.406: 126.05,26.99 125.73,27.3 | JP31.1 126.05,23.81
  Bottom 2.54: 125.73,27.3 123.19,29.84 123.19,33.35 X1.9 | 126.05,23.81 126.05,26.99
N$12
  Bottom 0.406: LED5.A R2.1
N$13
  Bottom 0.813: C4.P$1 76.2,28.89 JP13.6
N$14
  Bottom 1.778: R4.2 LED4.A
N$16
  Bottom 2.184: C6.1 IC1.30 62.23,55.88 64.77,53.34 80.01,53.34 L1.2
N$18
  Bottom 1.93: JP15.6 101.6,93.34 99.47,95.47 X2.1
N$21
  Bottom 0.813: JP23.1 IC1.20
N$22
  Bottom 0.813: JP23.2 IC1.19
N$23
  Bottom 0.813: IC1.26 JP6.2
N$24
  Bottom 1.93: JP15.5 104.14,97.08 X2.2
N$25
  Bottom 0.813: JP14.5 JP14.6
N$26
  Bottom 0.813: JP5.1 JP14.4
N$27
  Bottom 0.813: JP4.1 JP14.3
N$28
  Bottom 0.813: JP14.2 99.06,71.12 100.33,69.85 JP4.2 JP5.2 R3.1
N$29
  Bottom 1.93: JP15.4 106.68,97.08 X2.3
N$30
  Bottom 1.93: JP15.3 109.22,93.34 111.35,95.47 X2.4
N$31
  Bottom 0.813: JP9.5 JP9.6
N$32
  Bottom 0.813: JP8.1 JP9.4
N$33
  Bottom 0.813: JP7.1 JP9.3
N$35
  Bottom 1.93: JP10.6 77.47,93.34 75.34,95.47 X3.1
N$36
  Bottom 1.93: JP10.5 80.01,97.08 X3.2
N$37
  Bottom 1.93: JP10.4 82.55,97.08 X3.3
N$38
  Bottom 1.93: JP10.3 85.09,93.34 87.22,95.47 X3.4
N$39
  Bottom 0.813: JP16.5 JP16.6
N$40
  Bottom 0.813: JP12.1 JP16.4
N$41
  Bottom 0.813: JP11.1 JP16.3
N$42
  Bottom 0.813: JP16.2 50.8,71.12 52.07,69.85 JP11.2 JP12.2 R16.1
N$43
  Bottom 1.93: JP24.6 53.34,93.34 51.21,95.47 X4.1
N$44
  Bottom 1.93: JP24.5 55.88,97.08 X4.2
N$45
  Bottom 1.93: JP24.4 58.42,97.08 X4.3
N$46
  Bottom 1.93: JP24.3 60.96,93.34 63.09,95.47 X4.4
N$47
  Bottom 0.813: JP27.5 JP27.6
N$48
  Bottom 0.813: JP26.1 JP27.4
N$49
  Bottom 0.813: JP25.1 JP27.3
N$50
  Bottom 0.813: JP27.2 26.67,71.12 27.94,69.85 JP25.2 JP26.2 R17.1
N$51
  Bottom 1.93: JP28.6 29.21,93.34 27.08,95.47 X5.1
N$52
  Bottom 1.778: 31.75,97.08 X5.2
  Bottom 1.93: JP28.5 31.75,97.08
N$53
  Bottom 1.93: JP28.4 34.29,97.08 X5.3
N$54
  Bottom 1.93: JP28.3 36.83,93.34 38.96,95.47 X5.4
N$55
  Bottom 0.813: JP23.3 IC1.18
N$56
  Bottom 0.813: JP23.4 IC1.17
N$57
  Bottom 0.813: JP23.5 IC1.16
N$58
  Bottom 0.813: IC1.27 JP6.1
N$68
  Bottom 1.778: J3.PWR 88.9,25.13 D4.A
N$70
  Bottom 1.778: JP1.2 F1.1
N$72
  Bottom 1.778: D4.C JP1.1
N$90
  Bottom 0.813: JP9.2 74.93,71.12 76.2,69.85 JP7.2 JP8.2 R15.1
POUT1
  Bottom 0.813: IC1.4 44.45,44.45 43.18,45.72 36.2,45.72 34.92,44.45 34.92,29.84 33.02,27.94 R13.1
POUT2
  Bottom 0.813: R12.1 33.02,45.72 34.29,46.99 45.72,46.99 46.99,45.72 IC1.5
POUT3
  Bottom 1.27: R11.1 30.63,55.73 33.33,58.42 IC1.40
PS_ON  (via drill 0.61)
  Top 0.406: v113.03,57.15 v117.47,57.15
  Bottom 0.813: v113.03,57.15 111.76,58.42 IC1.21
  Bottom 1.778: v117.47,57.15 120.39,57.15 X1.14
RESET  (via drill 0.61)
  Top 0.406: v52.07,36.83 v58.42,36.83
  Bottom 0.406: C4.P$2 76.24,21.59
  Bottom 0.813: J1.5 v52.07,36.83 49.25,36.83 S1.3 | IC1.9 57.15,40.64 58.42,39.37 v58.42,36.83 60.33,34.92 60.33,27.62 64.14,23.81 66.4,23.81 67.35,22.86 72.39,22.86 73.62,21.63 C4.P$2 | 76.24,21.59 R1.1
RXD0
  Bottom 0.813: IC1.14 69.85,41.27 75.56,35.56 75.56,32.38 71.75,32.38 JP13.4
S1_DIR
  Bottom 0.813: JP14.8 114.3,66.04 113.03,64.77 100.33,64.77 97.79,62.23 91.44,62.23 90.17,60.96 80.01,60.96 IC1.24
S1_STEP
  Bottom 0.813: IC1.25 74.93,59.69 78.11,62.87 88.27,62.87 90.17,64.77 96.52,64.77 99.06,67.31 110.49,67.31 111.76,68.58 JP14.7
S2_DIR
  Bottom 0.813: JP9.8 90.17,67.31 87.63,64.77 76.2,64.77 74.93,63.5 69.85,63.5 67.31,60.96 IC1.28
S2_STEP
  Bottom 0.813: JP9.7 87.63,72.39 88.9,71.12 88.9,68.58 87.63,67.31 73.66,67.31 71.12,64.77 68.58,64.77 64.77,60.96 IC1.29
S3_DIR
  Bottom 0.813: JP16.8 66.04,67.31 64.77,66.04 53.34,66.04 52.07,64.77 IC1.34
S3_STEP
  Bottom 0.813: IC1.35 49.53,66.04 50.8,67.31 63.5,67.31 64.77,68.58 64.77,71.12 63.5,72.39 JP16.7
S4_DIR
  Bottom 0.813: JP27.8 41.91,67.31 46.99,62.23 IC1.36
S4_STEP
  Bottom 0.813: JP27.7 39.37,73.66 40.64,72.39 40.64,64.77 44.45,60.96 IC1.37
SCK  (via drill 0.61)
  Top 0.406: v54.61,38.1 v54.61,41.27 | v53.34,27.3 v55.88,27.3
  Bottom 0.813: J1.3 v54.61,38.1 47.62,38.1 46.35,36.83 46.35,28.57 47.62,27.3 v53.34,27.3 | v54.61,41.27 IC1.8 | v55.88,27.3 55.88,26.67 62.23,20.32 JP18.1
SCL
  Bottom 0.813: IC1.22 87.63,53.34 JP17.3 R10.2
SDA
  Bottom 0.813: IC1.23 87.63,50.8 JP17.2 R9.2
STEPPER_EN
  Bottom 0.813: JP27.1 24.13,77.47 25.4,78.74 42.55,78.74 43.81,77.47 43.81,68.58 45.09,67.31 46.99,67.31 48.26,68.58 JP16.1 48.26,77.47 49.53,78.74 66.67,78.74 67.94,77.47 67.94,67.31 | 67.94,67.31 71.12,67.31 72.39,68.58 JP9.1 72.39,77.47 73.66,78.74 90.81,78.74 92.08,77.47 92.08,68.58 93.34,67.31 95.25,67.31 96.52,68.58 JP14.1 | IC1.33 54.61,63.5 55.88,64.77 66.04,64.77 67.94,66.67 67.94,67.31
TEMP1
  Bottom 1.27: IC1.39 39.37,59.69 38.1,60.96 33.02,60.96 R7.2
  Bottom 1.778: JP32.2 C17.1 24.13,52.07 R7.2
TEMP2
  Bottom 1.27: 22.86,59.69 29.21,59.69 32.38,62.87 38.73,62.87 41.91,59.69 IC1.38
  Bottom 1.422: R8.2 22.86,59.69 22.86,60.96 C15.1 JP33.2
TXD0
  Bottom 0.813: IC1.15 72.39,40.64 76.83,36.2 76.83,31.11 74.3,31.11 JP13.5
VCC  (via drill 0.61)
  Top 0.406: v61.59,29.21 v57.15,29.21
  Bottom 0.406: C16.1 JP30.2
  Bottom 0.813: IC1.10 C1.1 59.69,39.37 61.59,37.47 v61.59,29.21 65.72,25.08 71.12,25.08 | JP17.4 R10.1 96.52,55.88 | L1.1 96.52,41.91 90.17,41.91 86.36,38.1 80.01,38.1 78.74,36.83 78.74,30.48 R1.2 80.01,24.13 | 104.14,45.72 104.14,49.53 102.87,50.8 102.87,54.61 101.6,55.88 R2.2 96.52,55.88 | v57.15,29.21 J1.2 | 71.12,25.08 72.07,24.13 v73.66,24.13 80.01,24.13 | 71.12,25.08 JP3.1 | JP19.3 80.01,15.24 80.01,19.05 v81.28,20.32 82.55,21.59 82.55,22.86 81.28,24.13 80.01,24.13 | 96.52,55.88 R9.1
  Bottom 1.778: JP30.2 JP31.2 | JP29.3 JP22.3 JP21.3 JP20.3 JP18.3 JP19.3
  Bottom 2.184: L1.1 102.87,44.45 104.14,45.72 110.49,45.72 111.76,44.45 111.76,41.91 113.03,40.64 113.03,22.86 115.57,20.32 JP2.1 R4.1 C16.1 JP31.2
X1
  Bottom 0.813: IC1.13 67.31,41.27 Y1.1 73.66,34.92 C3.1
X2
  Bottom 0.813: IC1.12 64.77,38.73 Y1.3 66.04,37.47 C2.1
Y_MAX
  Bottom 0.813: IC1.3 41.91,40.64 40.01,38.73 40.01,25.4 41.27,23.81 49.85,23.81 50.8,22.86 JP21.1
Z_MAX
  Bottom 0.813: IC1.1 36.83,21.59 JP29.1
Z_MIN
  Bottom 0.406: 38.42,39.37 38.42,39.69
  Bottom 0.813: 38.42,39.37 38.42,24.13 39.69,22.54 43.18,22.54 44.45,21.27 JP22.1 | 38.42,39.69 39.37,40.64 IC1.2
(copper drawn outside any net)
  shapes: Bottom area x17